# EAGLE design redLED (EAGLE 7.4.0)
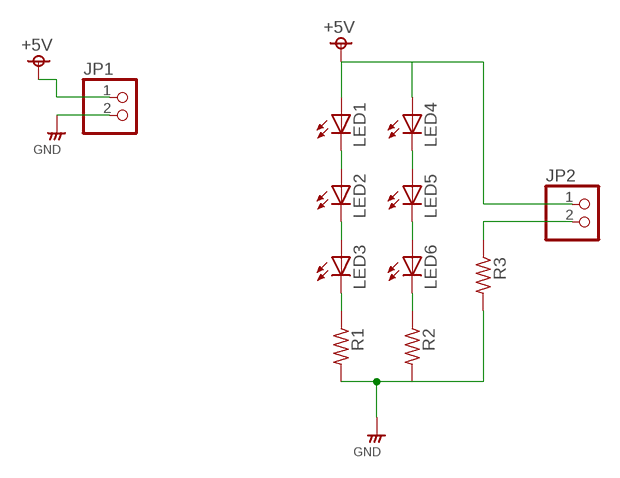
[diagram p0: schematic, sheet 1]

## Parts
JP1  PINHD-1X2"  [1*02]
JP2  PINHD-1X2"  [1*02]
LED1  LED5MM  [LED5MM]
LED2  LED5MM  [LED5MM]
LED3  LED5MM  [LED5MM]
LED4  LED5MM  [LED5MM]
LED5  LED5MM  [LED5MM]
LED6  LED5MM  [LED5MM]
R1  RESISTORS-3  [R_0.2]
R2  RESISTORS-3  [R_0.2]
R3  RESISTORS-4  [R_0.3]

## Nets
+5V: JP1.1 JP2.1 LED1.A LED4.A
GND: JP1.2 R1.2 R2.2 R3.2
N$1: JP2.2 R3.1
N$2: LED3.K(C) R1.1
N$3: LED1.K(C) LED2.A
N$4: LED2.K(C) LED3.A
N$5: LED6.K(C) R2.1
N$7: LED4.K(C) LED5.A
N$8: LED5.K(C) LED6.A

## Library data of the parts
JP1 JP2 = pinhead_s:PINHD-1X2: PIN HEADER
LED1-LED6 = LED_s:LED: LED OSRAM: - CHIPLED LG R971, LG N971, LY N971, LG Q971, LY Q971, LO R971, LY R971 LH N974, LH R974 LS Q976, LO Q976, LY Q976 LO Q996 - Hyper CHIPLED LW Q18S LB Q993, LB Q99A, LB R99A - SideLED LS A670, LO A670, LY A670, LG A670, LP A670 LB A673, LV A673, LT A673, LW A673 LH A674 LY A675 LS A676, LA A676, LO A676, LY A676, LW A676 LS A679, LY A679, LG A679 - Hyper Micro SIDELED® LS Y876, LA Y876, LO Y876, LY Y876 LT Y87S - SmartLED LW L88C, LW L88S LB L89C, LB L89S, LG L890 LS L89K, LO L89K, LY L89K LS L896, LA L896, LO L896, LY L896 - TOPLED LS T670, LO T670, LY T670, LG T670, LP T670 LSG T670, LSP T670, LSY T670, LOP T670, LYG T670 LG T671, LOG T671, LSG T671 LB T673, LV T673, LT T673, LW T673 LH T674 LS T676, LA T676, LO T676, LY T676, LB T676, LH T676, LSB T676, LW T676 LB T67C, LV T67C, LT T67C, LS T67K, LO T67K, LY T67K, LW E67C LS E67B, LA E67B, LO E67B, LY E67B, LB E67C, LV E67C, LT E67C LW T67C LS T679, LY T679, LG T679 LS T770, LO T770, LY T770, LG T770, LP T770 LB T773, LV T773, LT T773, LW T773 LH T774 LS E675, LA E675, LY E675, LS T675 LS T776, LA T776, LO T776, LY T776, LB T776 LHGB T686 LT T68C, LB T68C - Hyper Mini TOPLED® LB M676 - Mini TOPLED Santana® LG M470 LS M47K, LO M47K, LY M47K Source: http://www.osram.convergy.de - LUMILED® LXK2-PW12-R00, LXK2-PW12-S00, LXK2-PW14-U00, LXK2-PW14-V00 LXK2-PM12-R00, LXK2-PM12-S00, LXK2-PM14-U00 LXK2-PE12-Q00, LXK2-PE12-R00, LXK2-PE12-S00, LXK2-PE14-T00, LXK2-PE14-U00 LXK2-PB12-K00, LXK2-PB12-L00, LXK2-PB12-M00, LXK2-PB14-N00, LXK2-PB14-P00, LXK2-PB14-Q00 LXK2-PR12-L00, LXK2-PR12-M00, LXK2-PR14-Q00, LXK2-PR14-R00 LXK2-PD12-Q00, LXK2-PD12-R00, LXK2-PD12-S00 LXK2-PH12-R00, LXK2-PH12-S00 LXK2-PL12-P00, LXK2-PL12-Q00, LXK2-PL12-R00 Source: www.luxeon.com
R1-R3 = rcl__s:RESISTORS

## Board
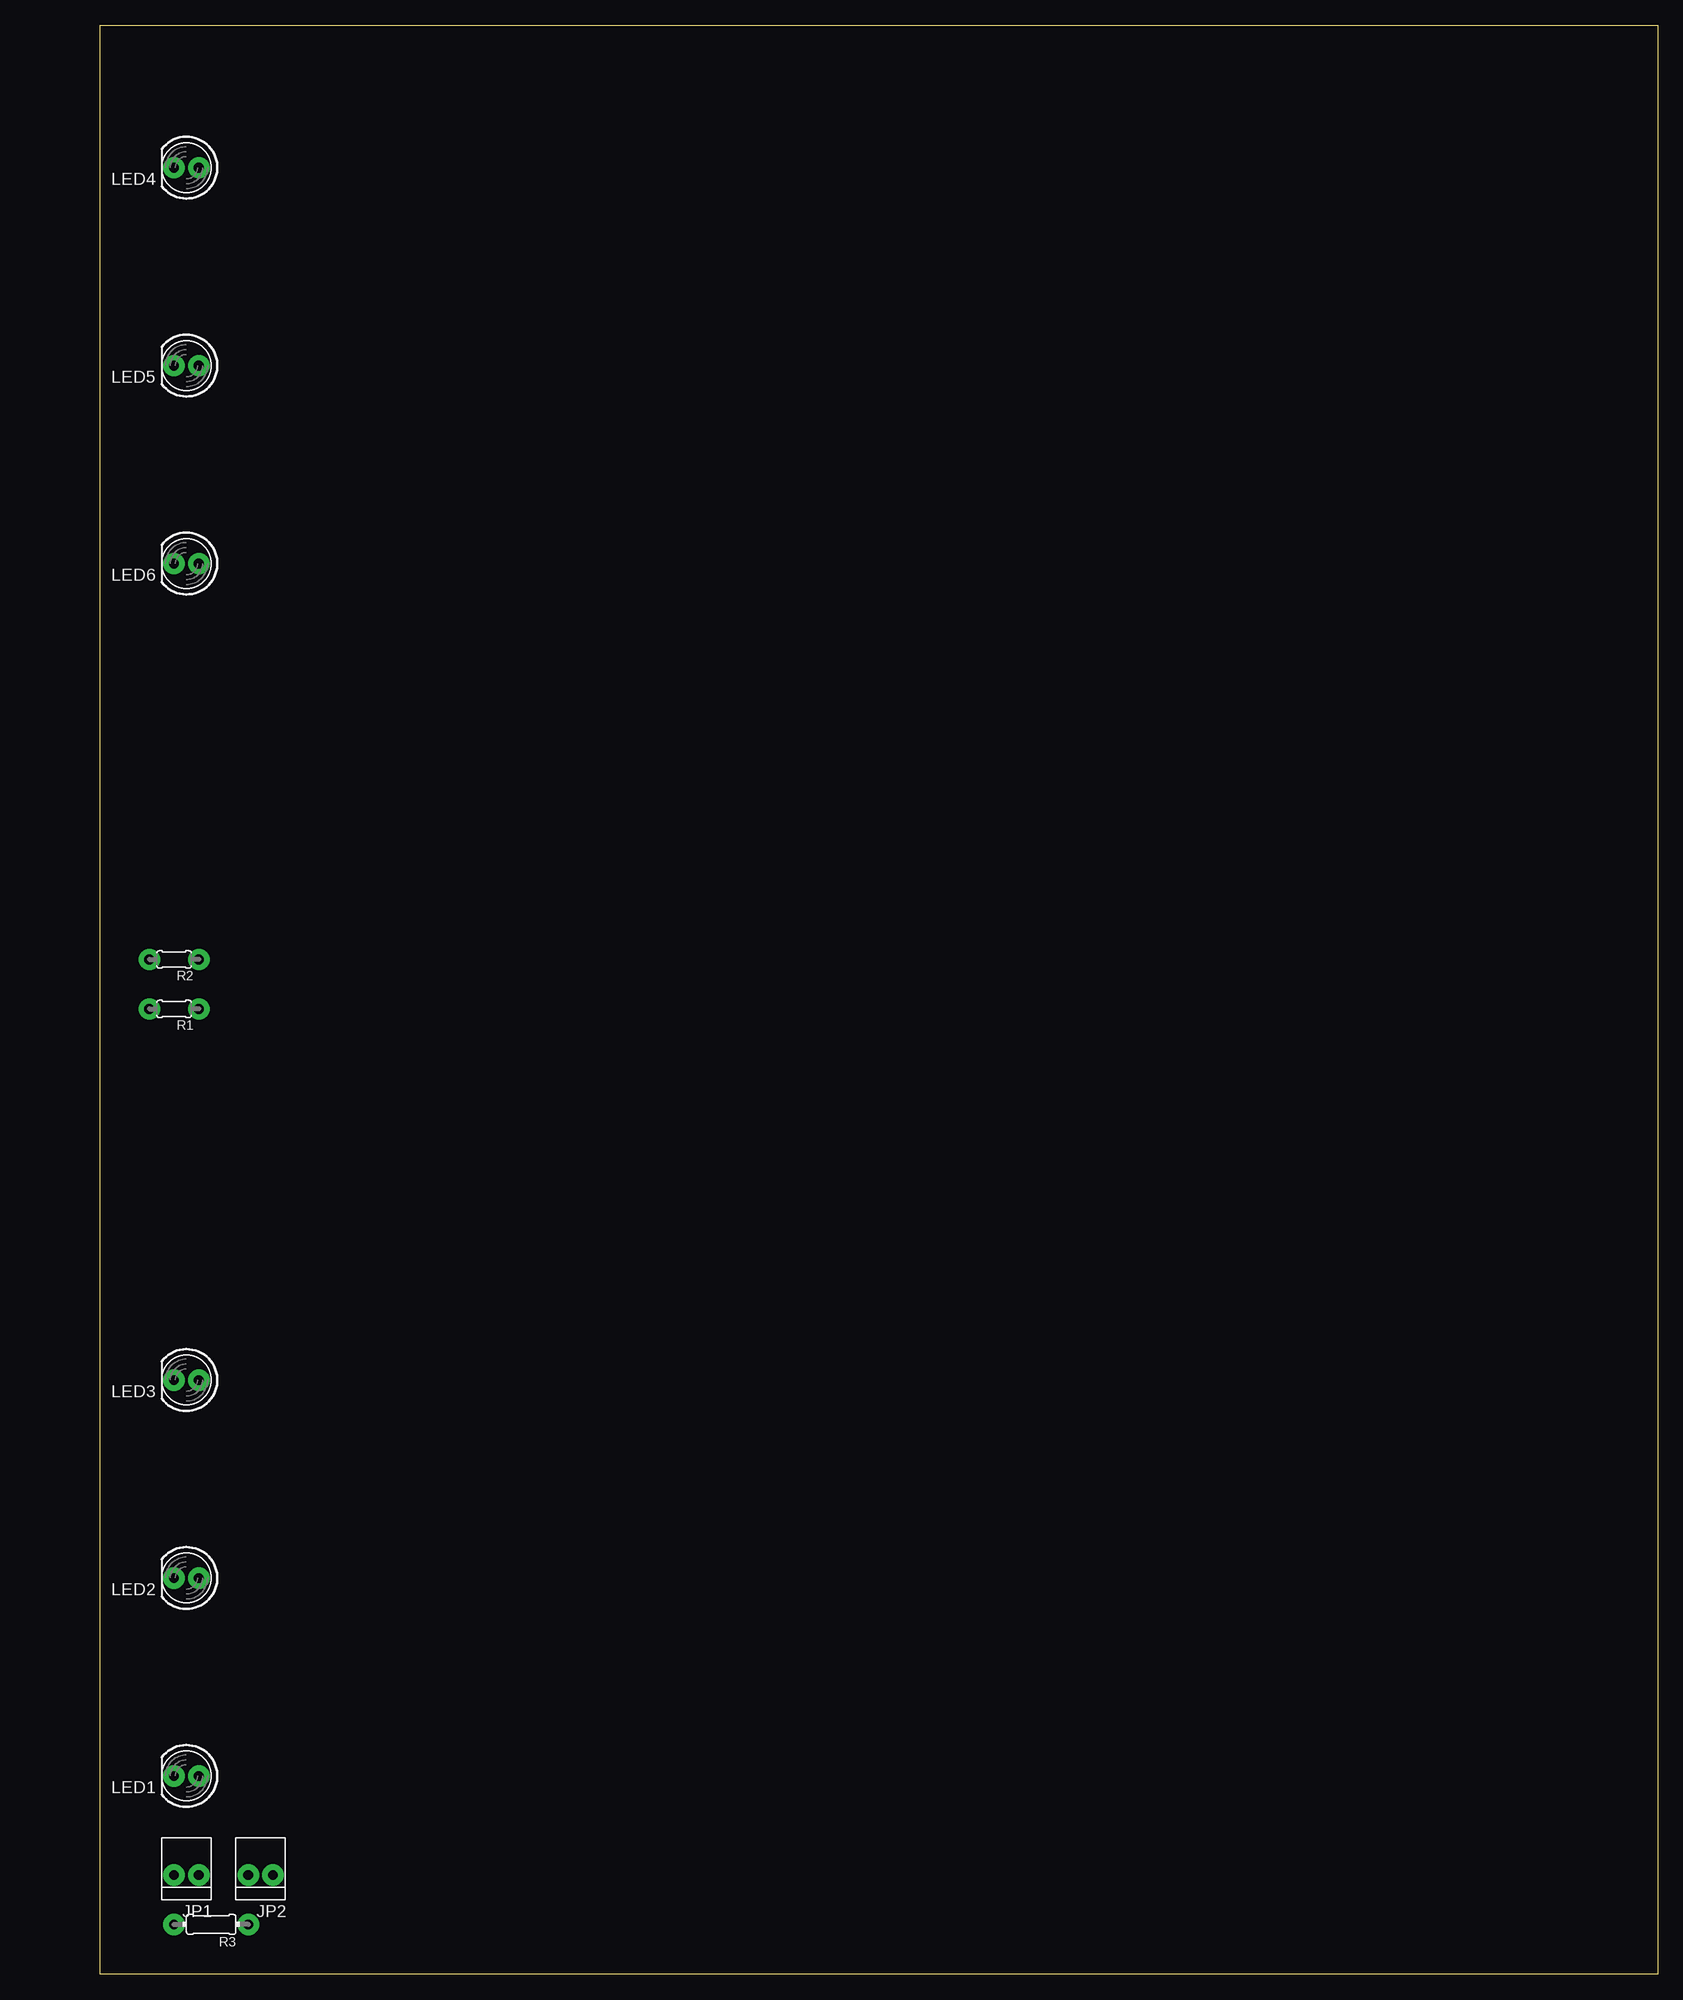
[diagram p1: board, top side]
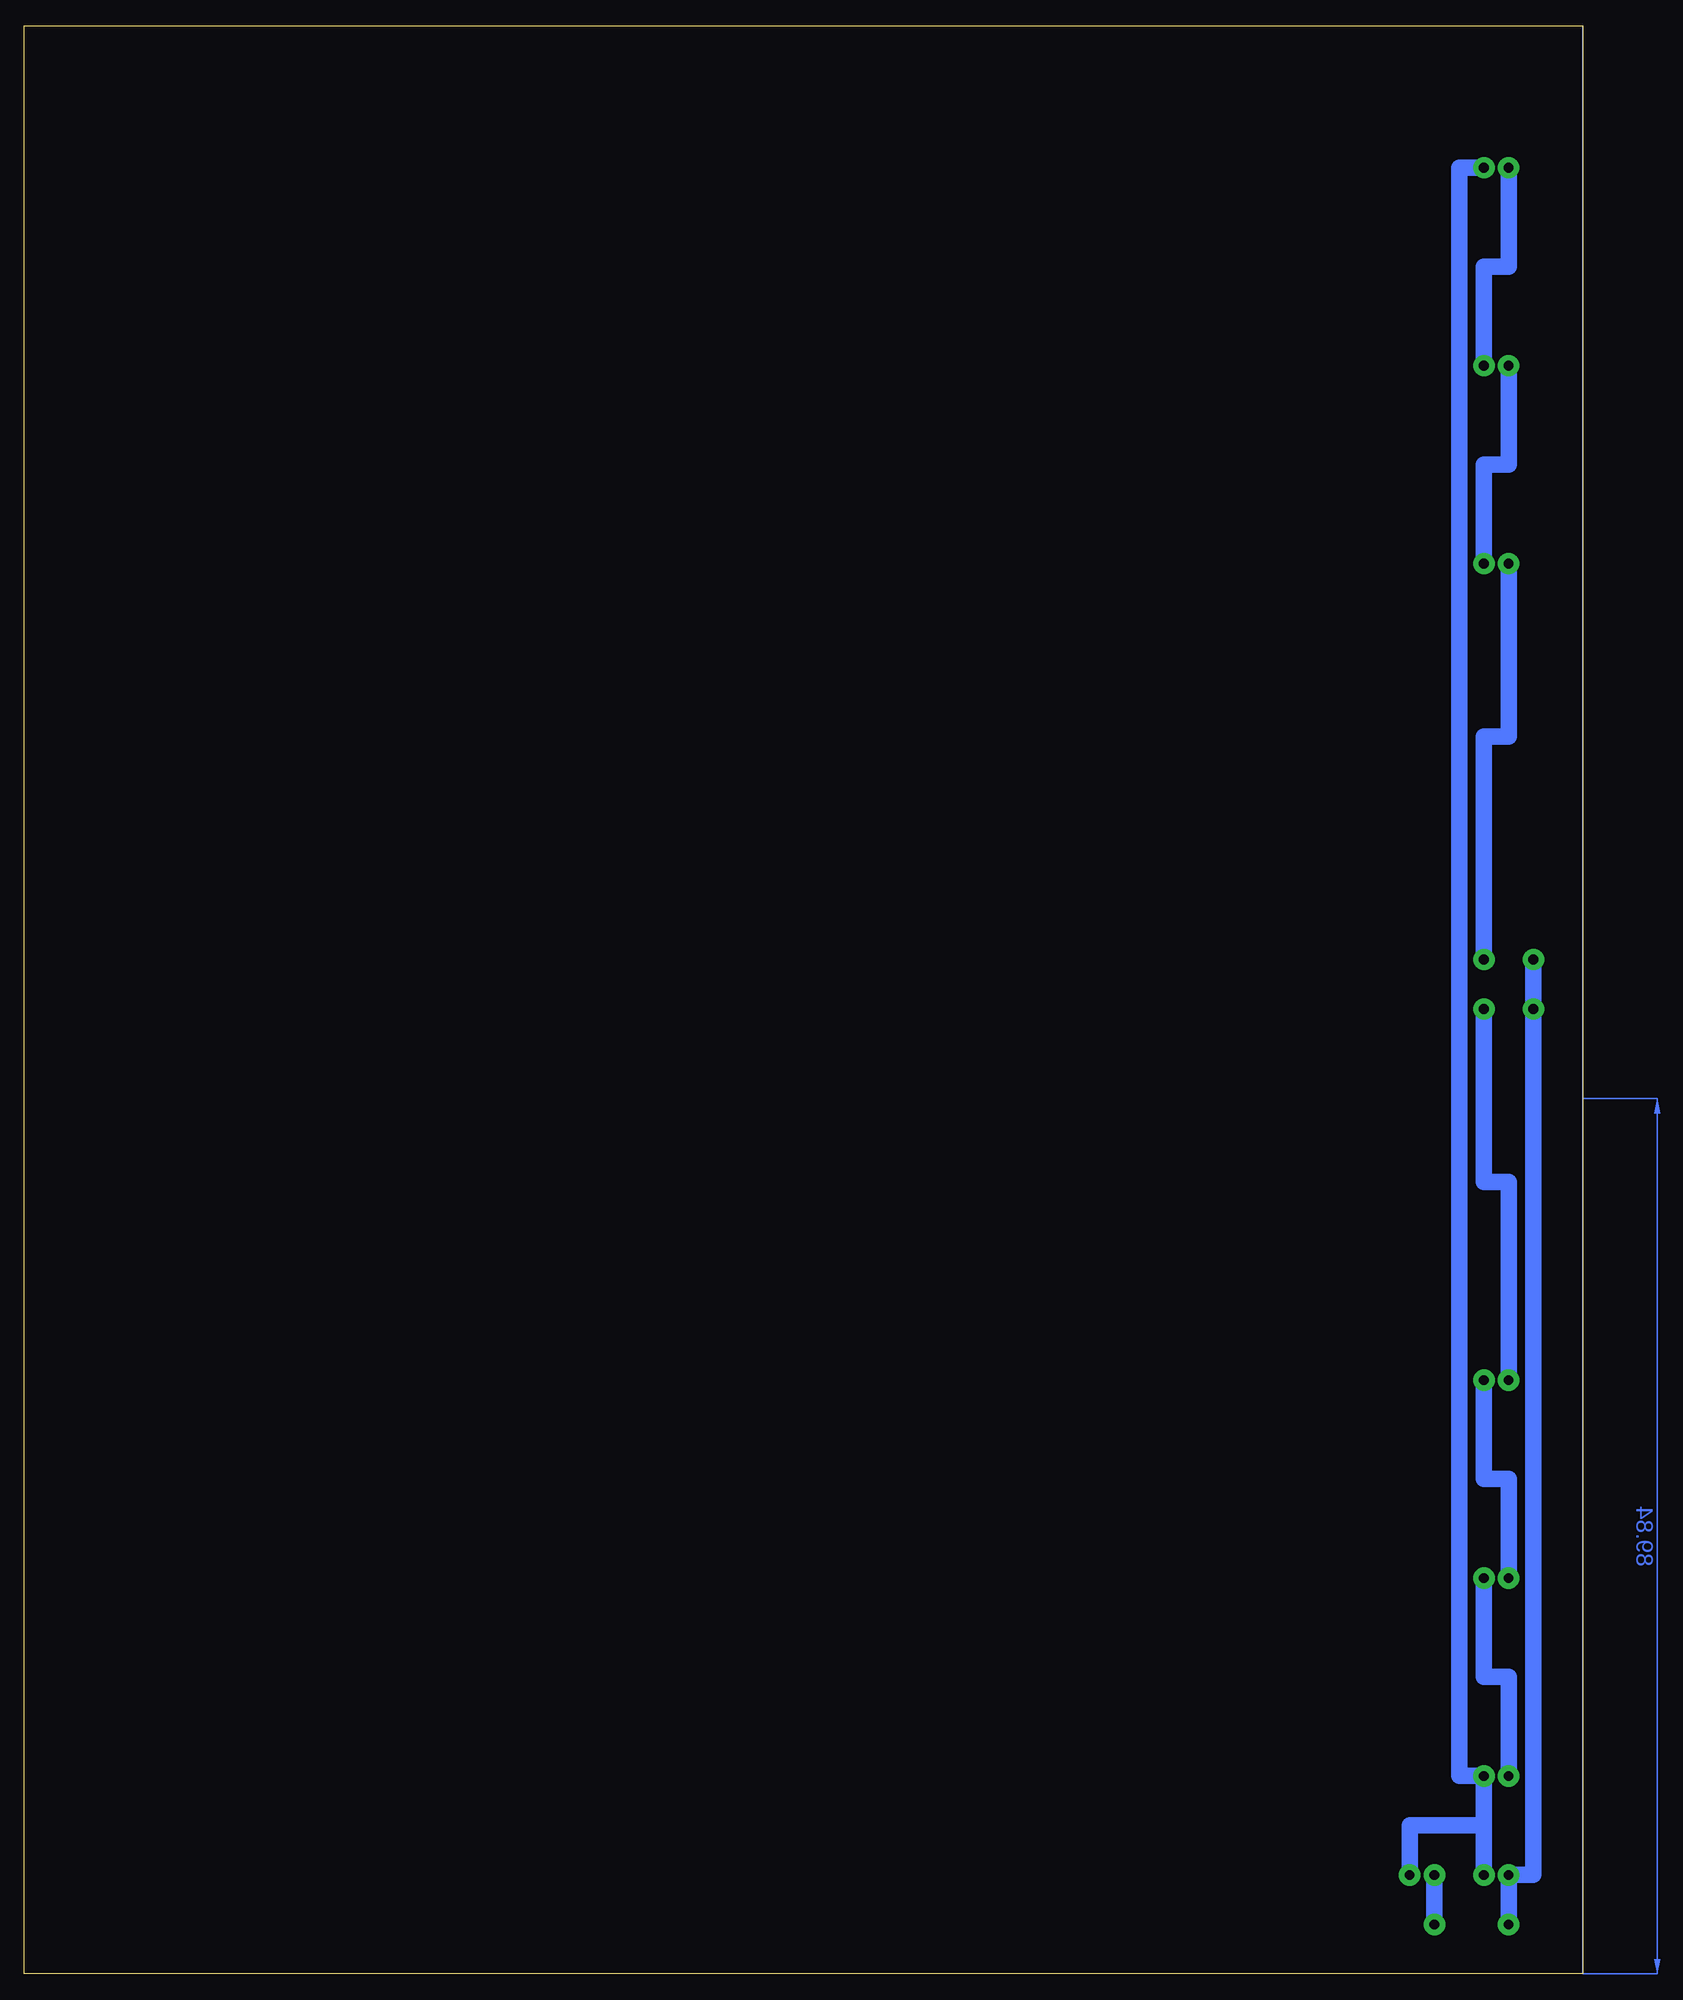
[diagram p2: board, bottom side, seen from below]

Size 160 x 200 mm. Coordinates in mm from the lower left corner, seen from the top.
Outline: 0,0 160,0 160,200 0,200 0,0
Copper layers (1*16): Top 0.035mm / dielectric 1.5mm / Bottom 0.035mm
Design rules "default": minimum track width 10mil, minimum drill 24mil, track to track 8mil, track to pad 8mil, pad to pad 8mil, via to via 8mil, smd to smd 8mil, copper to edge 40mil, drill to drill 8mil, minimum pad ring 10mil, minimum via ring 8mil, stop-mask expansion 4mil, vias tented up to drill 0mil, thermal gap 10mil

### Footprints (pad centres in the part's own frame; a part is rotated, then mirrored left to right if it is on the bottom)
1*02 = drill 1 pad 2.184: 1 -1.27,0; 2 1.27,0
LED5MM = drill 1 pad 2.184: A -1.27,0; K 1.27,0
R_0.2 = drill 1 pad 2.184: 1 -2.54,0; 2 2.54,0
R_0.3 = drill 1 pad 2.184: 1 -3.81,0; 2 3.81,0

### Placement (x,y rotation side)
JP1  8.89,10.16 180 top
JP2  16.51,10.16 180 top
LED1  8.89,20.32 180 top
LED2  8.89,40.64 180 top
LED3  8.89,60.96 180 top
LED4  8.89,185.42 180 top
LED5  8.89,165.1 180 top
LED6  8.89,144.78 180 top
R1  7.62,99.06 180 top
R2  7.62,104.14 180 top
R3  11.43,5.08 180 top

### Tracks (layer width: path | path; a pad name or v marks a point on that pad's centre or on a via)
+5V
  Bottom 1.676: LED4.A 12.7,185.42 12.7,20.32 LED1.A 10.16,15.24 | JP1.1 10.16,15.24 | 10.16,15.24 17.78,15.24 JP2.1
GND
  Bottom 1.676: R3.2 JP1.2 5.08,10.16 R1.2 R2.2
N$1
  Bottom 1.676: JP2.2 R3.1
N$2
  Bottom 1.676: LED3.K 7.62,81.28 10.16,81.28 R1.1
N$3
  Bottom 1.676: LED1.K 7.62,30.48 10.16,30.48 LED2.A
N$4
  Bottom 1.676: LED2.K 7.62,50.8 10.16,50.8 LED3.A
N$5
  Bottom 1.676: LED6.K 7.62,127 10.16,127 R2.1
N$7
  Bottom 1.676: LED4.K 7.62,175.26 10.16,175.26 LED5.A
N$8
  Bottom 1.676: LED5.K 7.62,154.94 10.16,154.94 LED6.A
(copper drawn outside any net)
  shapes: Bottom area x2